# Altium project Altium-TableTennisX3.PrjPcb
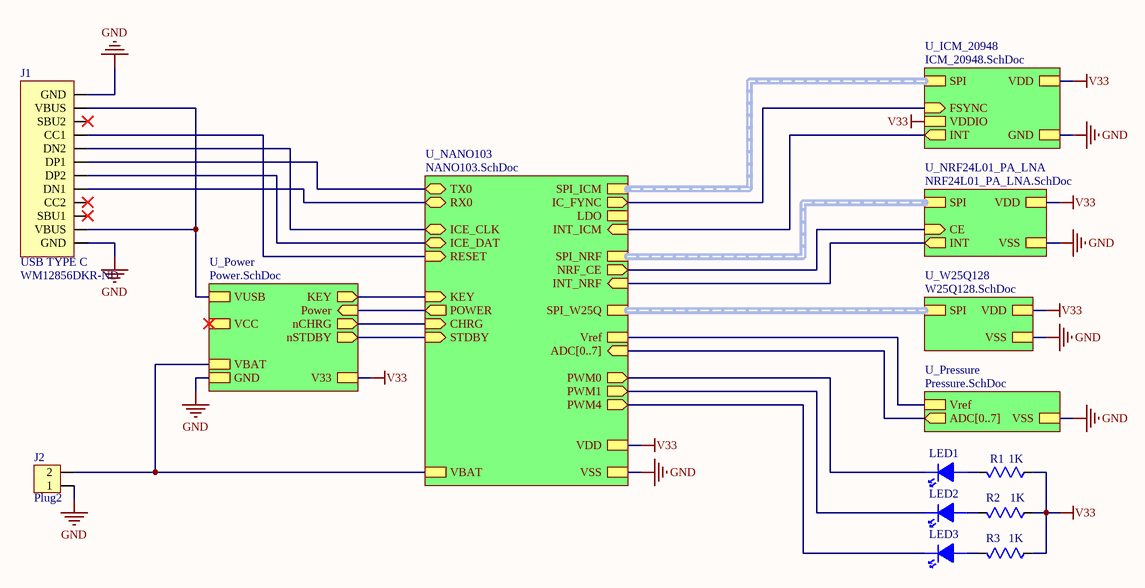
[diagram p0: Sheet1.SchDoc]
7 sheets, 62 parts. Net scope: hierarchical (ports join the sheet entries above them; power ports are global).
Board files: PCB1.PcbDoc, PCB2_bak.PcbDoc, PCB2.PcbDoc
Sheets:
  Sheet1.SchDoc
    U_Power = Power.SchDoc
    U_W25Q128 = W25Q128.SchDoc
    U_ICM_20948 = ICM_20948.SchDoc
    U_NRF24L01_PA_LNA = NRF24L01_PA_LNA.SchDoc
    U_NANO103 = NANO103.SchDoc
    U_Pressure = Pressure.SchDoc

## Sheet Sheet1.SchDoc
size A4

### Parts
J1  USB TYPE C  Supplier Part Number 1: WM12856DKR-ND  [USBC-SMD16F]
J2  Plug2  [Terminal_block_2pin_1.25mm_SMD]
LED1  LED  [SMD-0603_LED]  (value not drawn)
LED2  LED  [SMD-0603_LED]  (value not drawn)
LED3  LED  [SMD-0603_LED]  (value not drawn)
R1  value 1K  [RES_0402]  (hidden comment: Res)
R2  value 1K  [RES_0402]  (hidden comment: Res)
R3  value 1K  [RES_0402]  (hidden comment: Res)

### Sub-sheets
U_ICM_20948 = ICM_20948.SchDoc: GND, INT (out), FSYNC (in), VDD, VDDIO, SPI (harness SPI)
U_NANO103 = NANO103.SchDoc: ADC[0..7] (in), SPI_ICM (harness SPI), SPI_W25Q (harness SPI), SPI_NRF (harness SPI), INT_ICM (in), INT_NRF (in), CHRG (in), STDBY (in), KEY (in), POWER (out), TX0 (bidir), RX0 (bidir), PWM0 (out), PWM1 (out), PWM4 (out), Vref, VDD, VSS, RESET (in), NRF_CE (out), ICE_CLK (bidir), ICE_DAT (bidir), LDO, VBAT, IC_FYNC (out)
U_NRF24L01_PA_LNA = NRF24L01_PA_LNA.SchDoc: VDD, VSS, INT (out), CE (in), SPI (harness SPI)
U_Power = Power.SchDoc: VCC, KEY (out), GND, Power (in), V33, VUSB, nCHRG (out), nSTDBY (out), VBAT
U_Pressure = Pressure.SchDoc: VSS, ADC[0..7] (out), Vref
U_W25Q128 = W25Q128.SchDoc: SPI (harness SPI), VDD, VSS

### Nets
GND: J1.1(GND) J1.12(GND) J2.1 ; sheet U_Power/GND, sheet U_W25Q128/VSS, sheet U_ICM_20948/GND, sheet U_NRF24L01_PA_LNA/VSS, sheet U_NANO103/VSS, sheet U_Pressure/VSS  [project net VSS]
V33: R1.2 R2.2 R3.2 ; sheet U_Power/V33, sheet U_W25Q128/VDD, sheet U_ICM_20948/VDD, sheet U_ICM_20948/VDDIO, sheet U_NRF24L01_PA_LNA/VDD, sheet U_NANO103/VDD
/RESET: J1.4(CC1) ; sheet U_NANO103/RESET
CE: sheet U_NRF24L01_PA_LNA/CE, sheet U_NANO103/NRF_CE
ICE_CLK: J1.5(DN2) ; sheet U_NANO103/ICE_CLK
ICE_DAT: J1.7(DP2) ; sheet U_NANO103/ICE_DAT
INT: sheet U_NRF24L01_PA_LNA/INT, sheet U_NANO103/INT_NRF
INT1: sheet U_ICM_20948/INT, sheet U_NANO103/INT_ICM
PA12_PWM0: LED1.2 ; sheet U_NANO103/PWM0
PA13_PWM1: LED2.2 ; sheet U_NANO103/PWM1
PB11_PWM4: LED3.2 ; sheet U_NANO103/PWM4
PD6: sheet U_Power/Power, sheet U_NANO103/POWER
PD7: sheet U_Power/KEY, sheet U_NANO103/KEY
PD14: sheet U_Power/nSTDBY, sheet U_NANO103/STDBY
PD15: sheet U_Power/nCHRG, sheet U_NANO103/CHRG
PE5: sheet U_ICM_20948/FSYNC, sheet U_NANO103/IC_FYNC
RX0: J1.8(DN1) ; sheet U_NANO103/RX0
TX0: J1.6(DP1) ; sheet U_NANO103/TX0
VBAT: J2.2 ; sheet U_Power/VBAT, sheet U_NANO103/VBAT
Vref: sheet U_NANO103/Vref, sheet U_Pressure/Vref
NetC14_1: J1.2(VBUS) J1.11(VBUS) ; sheet U_Power/VUSB
NetLED1_1: LED1.1 R1.1
NetLED2_1: LED2.1 R2.1
NetLED3_1: LED3.1 R3.1

Not connected (* = marked no-connect by the designer): J1 3(SBU2)* 9(CC2)* 10(SBU1)*

### Buses and harness runs
bus sheet U_NANO103/ADC[0..7] = sheet U_Pressure/ADC[0..7]
harness sheet U_ICM_20948/SPI = sheet U_NANO103/SPI_ICM
harness sheet U_NANO103/SPI_NRF = sheet U_NRF24L01_PA_LNA/SPI
harness sheet U_NANO103/SPI_W25Q = sheet U_W25Q128/SPI

### Library data of the parts
J1 = USB TYPE C: USB Shielded I/O Receptacle; Type C; Right Angle; Surface Mount; Gold over Nickel; Manufacturer: Molex; Manufacturer Part Number: 105450-0101; Number of Contacts: 24; Current Rating: 5A; Mating Cycles: 10000; USB Standard: USB 3.1; Number of Ports: 1; Pitch: 0.5mm; Supplier 1: Digi-Key; RoHS: Yes; Category: Connectors; Stock 1: 21711; Pricing 1: 1=2.15000, 10=1.94900, 25=1.82960, 50=1.75000, 100=1.67050, 250=1.51140, 500=1.39208 (USD); Mount: Surface Mount,Through Hole,Horizontal; Case/Package: 0101; Number of Pins: 24; Contact Plating: Gold; Contact Material: Copper Alloy; Housing Material: Thermoplastic; Insulation Color: Black; Number of Terminals: 24; Min Operating Temperature: -30°C; Max Operating Temperature: 85°C; Packaging: Tape and Reel; Gender: Receptacle; Connector Type: USB; Orientation: Right Angle; Termination: Solder; Shielding: Shielded; Features: Shielded; Length: 8.94mm; REACH SVHC: Unknown; Flammability Rating: UL94 V-0; ComponentLink1URL: http://www.farnell.com/datasheets/2801634.pdf?src-supplier=Farnell; ComponentLink1Description: http://www.farnell.com/datasheets/2801634.pdf?src-supplier=Farnell; ComponentLink2URL: http://www.farnell.com/datasheets/2672741.pdf?src-supplier=Newark; ComponentLink2Description: http://www.farnell.com/datasheets/2672741.pdf?src-supplier=Newark; ComponentLink3URL: http://www.farnell.com/datasheets/2015275.pdf?src-supplier=Element14; ComponentLink3Description: http://www.farnell.com/datasheets/2015275.pdf?src-supplier=Element14; ComponentLink4URL: https://www.molex.com/pdm_docs/ps/PS-105448-001.pdf?src-supplier=Digi-Key; ComponentLink4Description: https://www.molex.com/pdm_docs/ps/PS-105448-001.pdf?src-supplier=Digi-Key; ComponentLink5URL: http://www.farnell.com/datasheets/2801634.pdf?src-supplier=Newark; ComponentLink5Description: http://www.farnell.com/datasheets/2801634.pdf?src-supplier=Newark; ComponentLink6URL: https://www.molex.com/pdm_docs/sd/1054500101_sd.pdf?src-supplier=Digi-Key; ComponentLink6Description: https://www.molex.com/pdm_docs/sd/1054500101_sd.pdf?src-supplier=Digi-Key; ComponentLink7URL: http://www.farnell.com/datasheets/2801634.pdf?src-supplier=Element14; ComponentLink7Description: http://www.farnell.com/datasheets/2801634.pdf?src-supplier=Element14; ComponentLink8URL: http://www.literature.molex.com/SQLImages/kelmscott/Molex/PDF_Images/987651-4081.PDF?src-supplier=Avnet; ComponentLink8Description: http://www.literature.molex.com/SQLImages/kelmscott/Molex/PDF_Images/987651-4081.PDF?src-supplier=Avnet; ComponentLink9URL: http://www.literature.molex.com/SQLImages/kelmscott/Molex/PDF_Images/987651-4081.PDF?src-supplier=Avnet+Asia; ComponentLink9Description: http://www.literature.molex.com/SQLImages/kelmscott/Molex/PDF_Images/987651-4081.PDF?src-supplier=Avnet+Asia

## Sheet Power.SchDoc
size A4
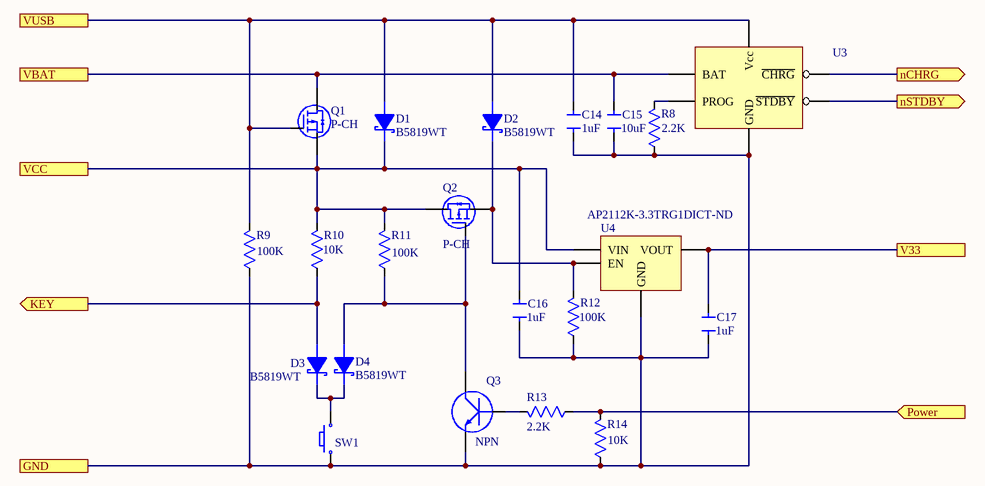
[diagram p1: Power.SchDoc]

### Parts
C14  value 1uF  [CAP_0402]  (hidden comment: Cap)
C15  value 10uF  [Cap_0603]  (hidden comment: Cap)
C16  value 1uF  [CAP_0402]  (hidden comment: Cap)
C17  value 1uF  [CAP_0402]  (hidden comment: Cap)
D1  B5819WT  [SOD-523]
D2  B5819WT  [SOD-523]
D3  B5819WT  [SOD-523]
D4  B5819WT  [SOD-523]
Q1  Polarity: P-CH  [SOT-23]  (hidden comment: SI2301DS-T1)
Q2  Polarity: P-CH  [SOT-23]  (hidden comment: SI2301DS-T1)
Q3  Polarity: NPN  [SOT-23]  (hidden comment: MMS9013L-TP)
R8  value 2.2K  [RES_0402]  (hidden comment: Res)
R9  value 100K  [RES_0402]  (hidden comment: Res)
R10  value 10K  [RES_0402]  (hidden comment: Res)
R11  value 100K  [RES_0402]  (hidden comment: Res)
R12  value 100K  [RES_0402]  (hidden comment: Res)
R13  value 2.2K  [RES_0402]  (hidden comment: Res)
R14  value 10K  [RES_0402]  (hidden comment: Res)
SW1  SPST  [ST01-111]  (value not drawn)
U3  TP4059  [SOT23-6]  (value not drawn)
U4  Supplier Part Number 1: AP2112K-3.3TRG1DICT-ND  [SOT23-5]  (hidden comment: AP2112K-3.3TRG1)

### Ports
GND, KEY (out), nCHRG (out), nSTDBY (out), Power (in), V33, VBAT, VCC, VUSB

### Nets
V33: C17.1 U4.4(VOUT) ; port V33
VSS: C14.2 C15.2 C16.2 C17.2 Q3.3 R8.2 R9.2 R12.2 R14.2 SW1.2 U3.4(GND) U4.3(GND) ; port GND
PD6: R13.2 R14.1 ; port Power
PD7: D3.1 R10.2 ; port KEY
PD14: U3.3(~{STDBY}) ; port nSTDBY
PD15: U3.2(~{CHRG}) ; port nCHRG
VBAT: C15.1 Q1.1 U3.6(BAT) ; port VBAT
NetC14_1: C14.1 D1.1 D2.1 Q1.2 R9.1 U3.1(Vcc) ; port VUSB
NetC16_1: C16.1 D1.2 Q1.3 Q2.1 R10.1 R11.1 U4.1(VIN) ; port VCC
NetD2_2: D2.2 Q2.3 R12.1 U4.2(EN)
NetD3_2: D3.2 D4.2 SW1.1
NetD4_1: D4.1 Q2.2 Q3.1 R11.2
NetQ3_2: Q3.2 R13.1
NetR8_1: R8.1 U3.5(PROG)

### Library data of the parts
D1-D4 = B5819WT: Diode Schottky 40V 1A 2-Pin SOD-523 T/R; Manufacturer: MCC; Manufacturer Part Number: B5819W-TP; Max Reverse Voltage (DC): 20V; Element Configuration: Single; Forward Voltage: 550mV; Max Forward Surge Current (Ifsm): 10A; Peak Reverse Current: 1mA; Max Power Dissipation: 250mW; Supplier 1: Digi-Key; RoHS: Yes; Category: Rectifier Diodes; Stock 1: 1380; Pricing 1: 1=0.38000, 10=0.28000, 25=0.24520, 100=0.13300, 250=0.13232, 500=0.10850, 1000=0.08050 (USD); Mount: Surface Mount; Min Operating Temperature: -65°C; Max Operating Temperature: 125°C; Reverse Voltage (DC): 40V; Average Rectified Current: 1A; Package Quantity: 3000; Packaging: Tape and Reel; Forward Current: 1A; Max Repetitive Reverse Voltage (Vrrm): 40V; ComponentLink1URL: https://datasheet.ciiva.com/6378/b5817w-b5819wsod-123-6378255.pdf?src-supplier=Digi-Key; ComponentLink1Description: https://datasheet.ciiva.com/6378/b5817w-b5819wsod-123-6378255.pdf?src-supplier=Digi-Key; Supplier Part Number 1: B5819WT
Q1 Q2 = SI2301DS-T1: Trans MOSFET P-CH 20V 2.3A 3-Pin TO-236 T/R; pin to pad: 1>2 2>1; Manufacturer: Vishay Siliconix; Rise Time: 36ns; Drain to Source Resistance: 130mR; Gate to Source Voltage (Vgs): 8V; Max Power Dissipation: 1.25W; Turn-Off Delay Time: 42ns; Turn-On Delay Time: 13ns; Number of Elements: 1; Element Configuration: Single; Drain to Source Voltage (Vdss): -20V; Supplier 1: Component Sense; Manufacturer Part Number: SI2301DS-T1; RoHS: No; Category: MOSFETs; Stock 1: 12531; Pricing 1: 143=0.17500, 500=0.15000, 1000=0.10000, 5000=0.09000, 10000=0.08000 (USD); Mount: Surface Mount; Case/Package: SOT-23-3; Number of Pins: 3; Weight: 0.050717oz; Min Operating Temperature: -55°C; Max Operating Temperature: 150°C; Packaging: Tape and Reel; Package Quantity: 3000; Continuous Drain Current (ID): 2.3A; Fall Time: 36ns; Power Dissipation: 1.25W; Number of Channels: 1; Length: 3.04mm; Height: 1.02mm; Width: 1.4mm; ComponentLink1URL: https://datasheet.ciiva.com/13048/70627-115154-13048148.pdf?src-supplier=Mouser; ComponentLink1Description: https://datasheet.ciiva.com/13048/70627-115154-13048148.pdf?src-supplier=Mouser; Supplier Part Number 1: SI2301DS-T1
Q3 = MMS9013L-TP: Trans GP BJT NPN 25V 0.5A 3-Pin SOT-23 T/R; pin to pad: 1>3 2>1 3>2; Manufacturer: MCC; Frequency: 150MHz; Number of Elements: 1; Collector Base Voltage (VCBO): 40V; Emitter Base Voltage (VEBO): 5V; Power Dissipation: 300mW; Manufacturer Part Number: MMS9013L-TP; RoHS: Yes; Category: BJTs; Mount: Surface Mount; Case/Package: SOT-23; Number of Pins: 3; Min Operating Temperature: -55°C; Max Operating Temperature: 150°C; Packaging: Tape and Reel; Collector Emitter Voltage (VCEO): 25V; ComponentLink1URL: http://components.arrow.com/part/dataview/51062823S110403N2022?src-supplier=Arrow; ComponentLink1Description: http://components.arrow.com/part/dataview/51062823S110403N2022?src-supplier=Arrow; Supplier 1: Arrow; Supplier Part Number 1: MMS9013-L-TP
SW1 = Switch_Button1
U3 = TP4059: 600MA SOT23-6; pin to pad: 1>4 2>1 3>5 4>2 5>6 6>3; ComponentLink1Description: Datasheet; ComponentLink1URL: http://www.tp-asic.com/res/tp-asic/pdres/201403/TP4059.pdf
U4 = AP2112K-3.3TRG1: IC REG LINEAR 3.3V 600MA SOT23-5; pin to pad: 2>3 3>2 4>5; Manufacturer: Diodes; Number of Regulators: 1; Quiescent Current: 55uA; Polarity: Positive; Max Input Voltage: 6V; Min Input Voltage: 2.5V; Accuracy: 1.5%; Dropout Voltage: 250mV; Output Type: Fixed; Supplier 1: Digi-Key; Manufacturer Part Number: AP2112K-3.3TRG1; RoHS: Yes; Category: Voltage Regulators - Linear; Stock 1: 54786; Pricing 1: 1=0.47000, 10=0.35500, 25=0.32000, 100=0.17450, 250=0.16872, 500=0.15126, 1000=0.11636 (USD); Mount: Surface Mount; Case/Package: SOT-23-5; Number of Pins: 5; Min Operating Temperature: -40°C; Max Operating Temperature: 85°C; Output Current: 600mA; Max Output Current: 600mA; Output Voltage: 3.3V; Number of Outputs: 1; Package Quantity: 1; Packaging: Tape and Reel; Length: 3.1mm; Height: 1.3mm; Width: 1.7mm; Lead Free: Lead Free; ComponentLink1URL: https://datasheet.ciiva.com/29569/ap2112-29569919.pdf?src-supplier=Digi-Key; ComponentLink1Description: https://datasheet.ciiva.com/29569/ap2112-29569919.pdf?src-supplier=Digi-Key; ComponentLink2URL: https://datasheet.ciiva.com/30016/ap2112-30016792.pdf?src-supplier=Avnet; ComponentLink2Description: https://datasheet.ciiva.com/30016/ap2112-30016792.pdf?src-supplier=Avnet; ComponentLink3URL: https://datasheet.ciiva.com/29569/ap2112-29569917.pdf?src-supplier=Digi-Key; ComponentLink3Description: https://datasheet.ciiva.com/29569/ap2112-29569917.pdf?src-supplier=Digi-Key; ComponentLink4URL: https://datasheet.ciiva.com/29569/ap2112-29569918.pdf?src-supplier=Digi-Key; ComponentLink4Description: https://datasheet.ciiva.com/29569/ap2112-29569918.pdf?src-supplier=Digi-Key

## Sheet W25Q128.SchDoc
size A4
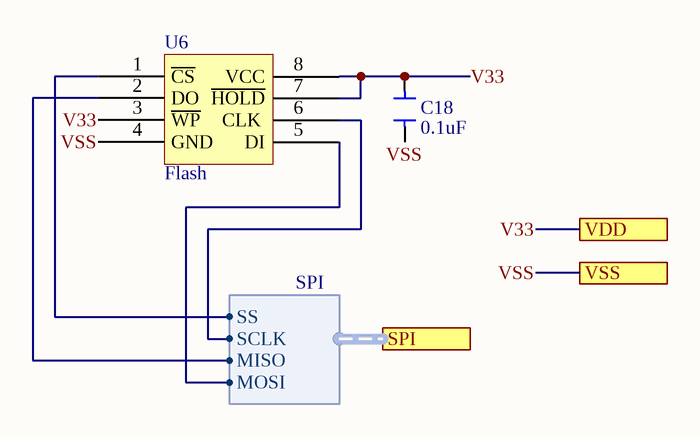
[diagram p2: W25Q128.SchDoc]

### Parts
C18  value 0.1uF  [CAP_0402]  (hidden comment: Cap)
U6  Flash  [8-Pin SOIC 208-mil]

### Ports
SPI (harness SPI), VDD, VSS

### Harnesses
SPI: SS, MISO, MOSI, SCLK

### Nets
V33: C18.1 U6.3(~{WP}) U6.7(~{HOLD}) U6.8(VCC) ; port VDD
VSS: C18.2 U6.4(GND) ; port VSS
SPI1_MISO: U6.2(DO) ; port SPI.MISO
SPI1_MOSI: U6.5(DI) ; port SPI.MOSI
SPI1_SCLK: U6.6(CLK) ; port SPI.SCLK
SPI1_SS: U6.1(~{CS}) ; port SPI.SS

### Library data of the parts
U6 = W25QXX

## Sheet ICM_20948.SchDoc
size A4
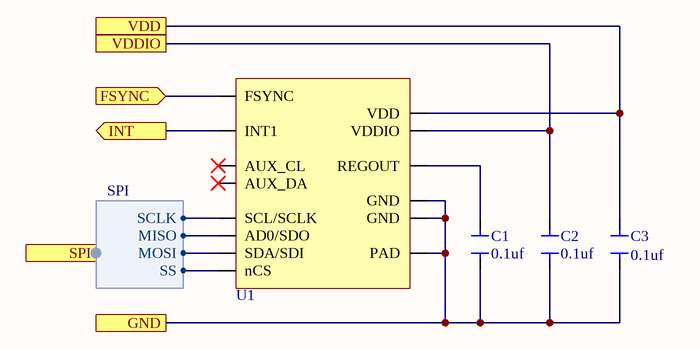
[diagram p3: ICM_20948.SchDoc]

### Parts
C1  value 0.1uf  [CAP_0402]  (hidden comment: Cap)
C2  value 0.1uf  [CAP_0402]  (hidden comment: Cap)
C3  value 0.1uf  [CAP_0402]  (hidden comment: Cap)
U1  ICM-20948  [QFN_24_3X3]  (value not drawn)

### Ports
FSYNC (in), GND, INT (out), SPI (harness SPI), VDD, VDDIO

### Harnesses
SPI: SS, SCLK, MISO, MOSI

### Nets
V33: C2.1 C3.1 U1.8(VDDIO) U1.13(VDD) ; port VDD, port VDDIO
VSS: C1.2 C2.2 C3.2 U1.18(GND) U1.20(GND) U1.25(PAD) ; port GND
INT1: U1.12(INT1) ; port INT
PE5: U1.11(FSYNC) ; port FSYNC
SPI0_MISO: U1.9(AD0/SDO) ; port SPI.MISO
SPI0_MOSI: U1.24(SDA/SDI) ; port SPI.MOSI
SPI0_SCLK: U1.23(SCL/SCLK) ; port SPI.SCLK
SPI0_SS: U1.22(nCS) ; port SPI.SS
NetC1_1: C1.1 U1.10(REGOUT)

Not connected (* = marked no-connect by the designer): U1 7(AUX_CL)* 21(AUX_DA)*

### Library data of the parts
U1 = ICM-20948: Accelerometer, Gyroscope, Magnetometer, 9 Axis Sensor IÂ²C, SPI Output; MF: TDK InvenSense; Availability: Unavailable; SnapEDA_Link: https://www.snapeda.com/parts/ICM-20948/TDK%20InvenSense/view-part/578927/?ref=snap; Price: None; Value: *; Package: QFN-24 InvenSense; MP: ICM-20948

## Sheet NRF24L01_PA_LNA.SchDoc
size A4
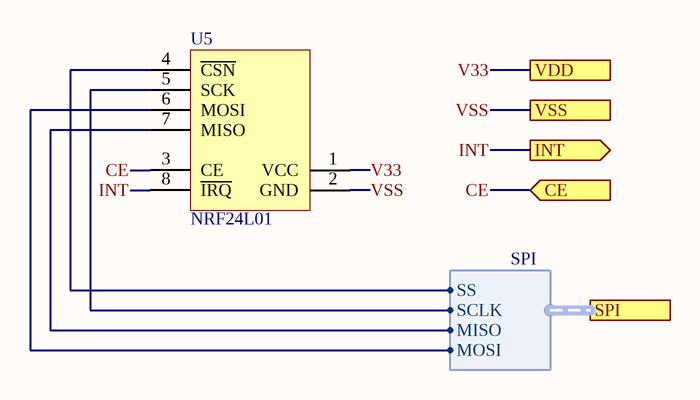
[diagram p4: NRF24L01_PA_LNA.SchDoc]

### Parts
U5  NRF24L01  [NRF24L01P+PA+LNA+IPX]

### Ports
CE (in), INT (out), SPI (harness SPI), VDD, VSS

### Harnesses
SPI: SS, MISO, MOSI, SCLK

### Nets
V33: U5.1(VCC) ; port VDD
VSS: U5.2(GND) ; port VSS
CE: U5.3(CE) ; port CE
INT: U5.8(~{IRQ}) ; port INT
SPI2_MISO: U5.7(MISO) ; port SPI.MISO
SPI2_MOSI: U5.6(MOSI) ; port SPI.MOSI
SPI2_SCLK: U5.5(SCK) ; port SPI.SCLK
SPI2_SS: U5.4(~{CSN}) ; port SPI.SS

### Library data of the parts
U5 = NRF24L01_module: pin to pad: 2>8 3>2 4>3 5>4 6>5 7>6 8>7

## Sheet NANO103.SchDoc
size A3
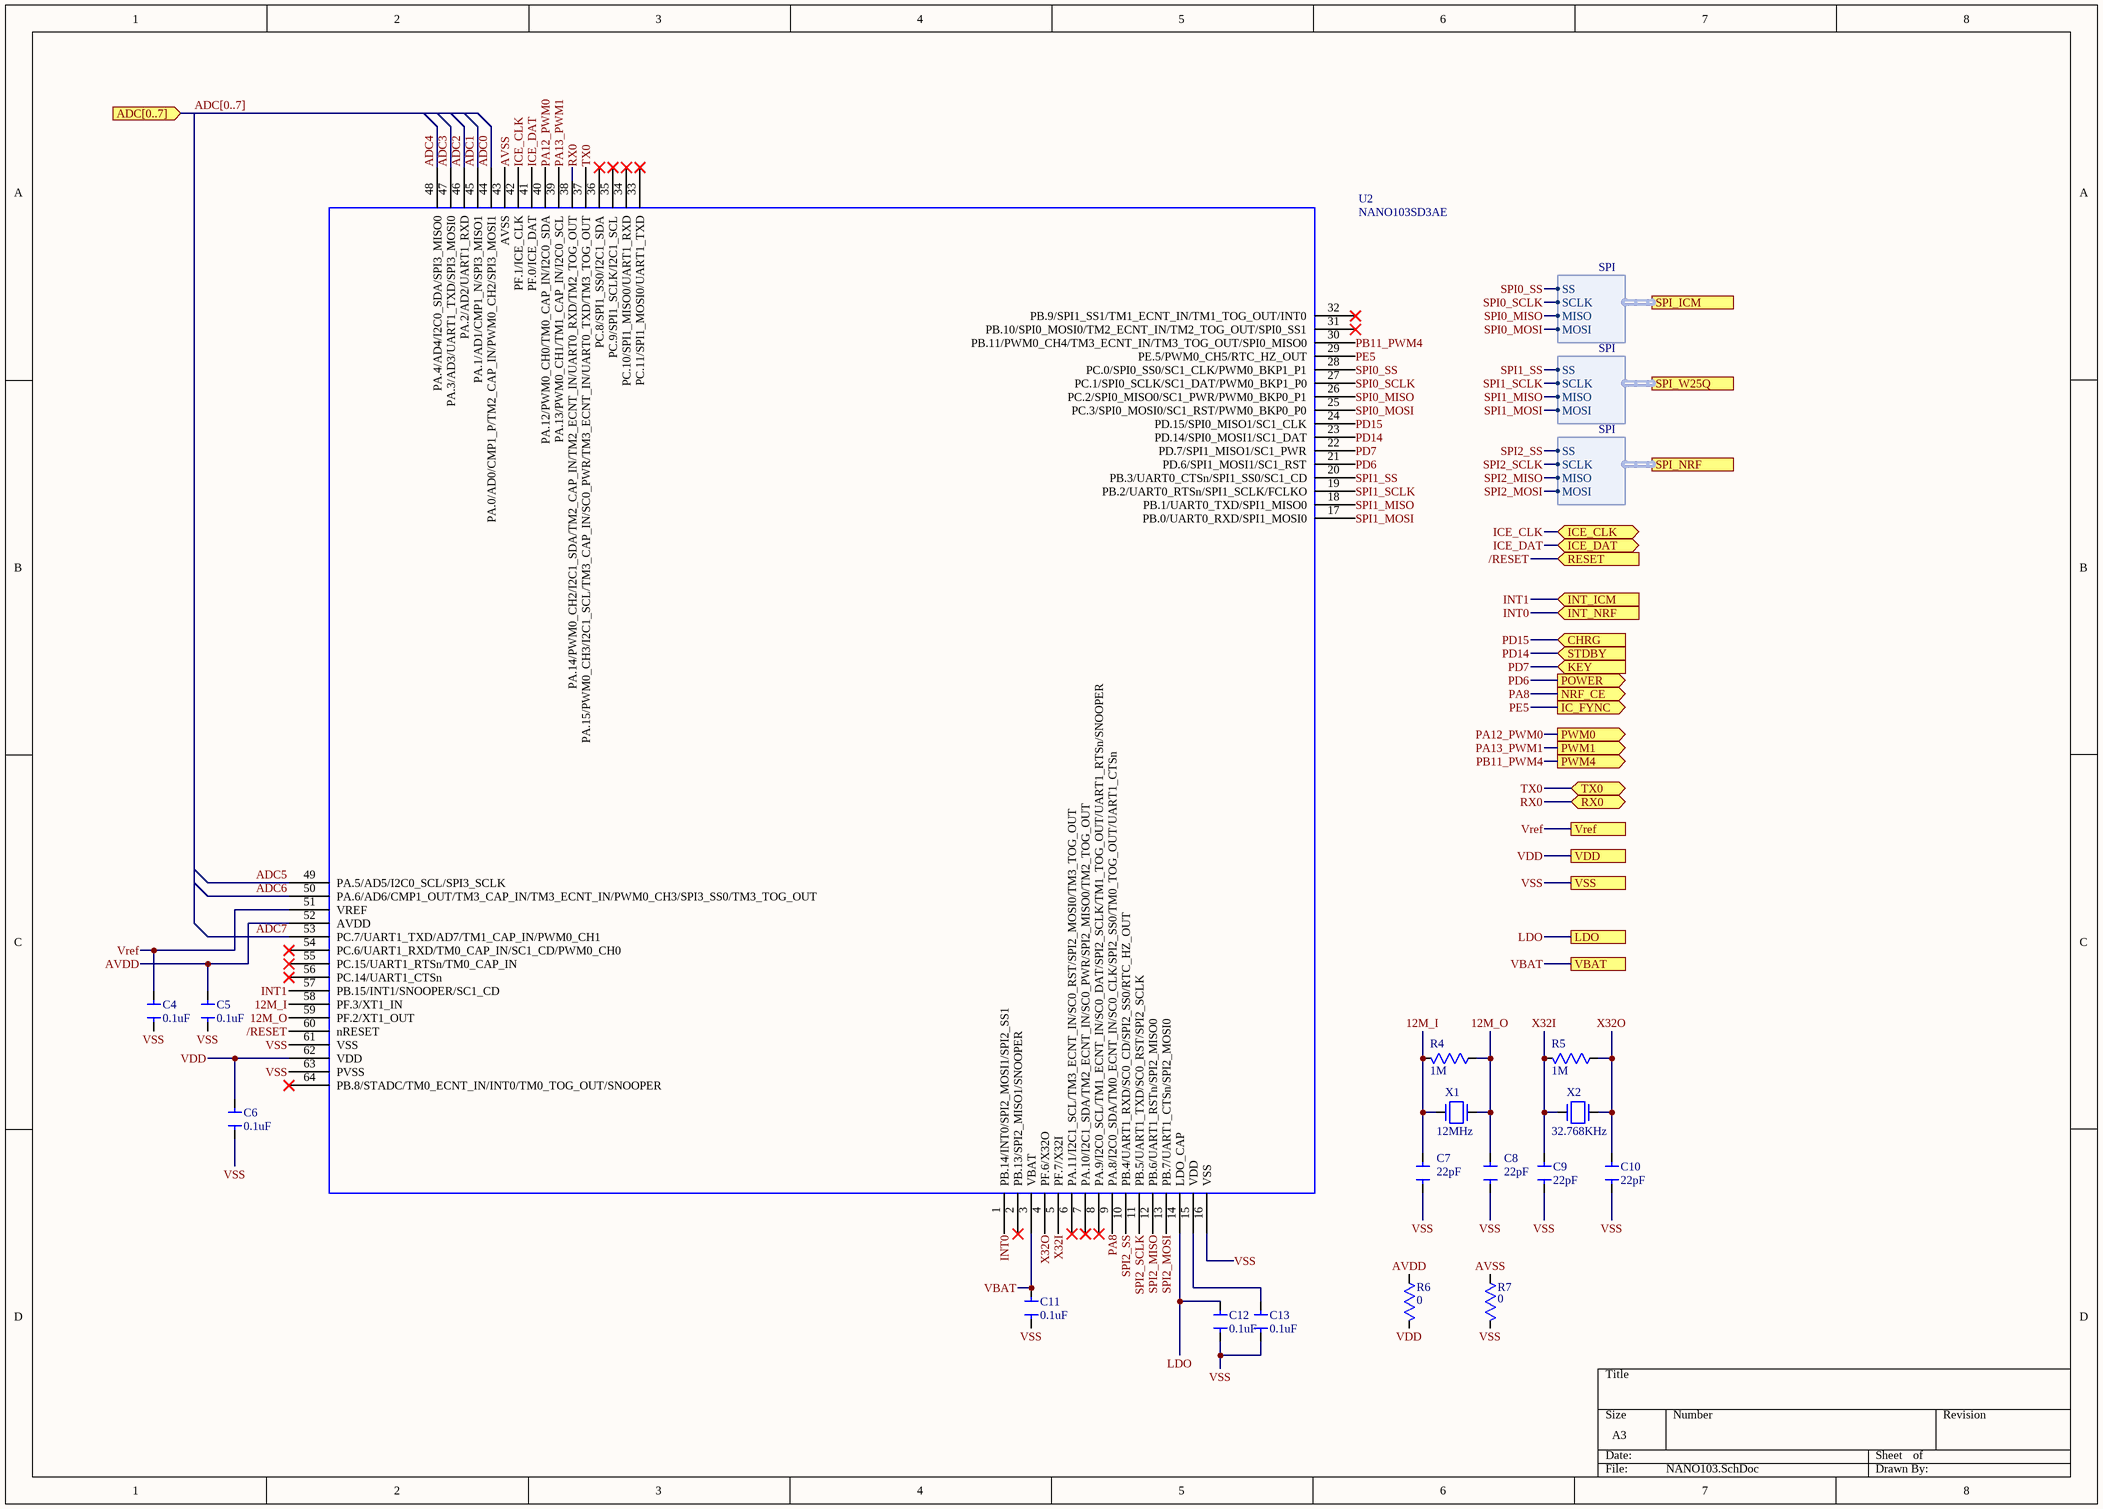
[diagram p5: NANO103.SchDoc]

### Parts
C4  value 0.1uF  [CAP_0402]  (hidden comment: Cap)
C5  value 0.1uF  [CAP_0402]  (hidden comment: Cap)
C6  value 0.1uF  [CAP_0402]  (hidden comment: Cap)
C7  value 22pF  [CAP_0402]  (hidden comment: Cap)
C8  value 22pF  [CAP_0402]  (hidden comment: Cap)
C9  value 22pF  [CAP_0402]  (hidden comment: Cap)
C10  value 22pF  [CAP_0402]  (hidden comment: Cap)
C11  value 0.1uF  [CAP_0402]  (hidden comment: Cap)
C12  value 0.1uF  [CAP_0402]  (hidden comment: Cap)
C13  value 0.1uF  [CAP_0402]  (hidden comment: Cap)
R4  value 1M  [RES_0402]  (hidden comment: Res)
R5  value 1M  [RES_0402]  (hidden comment: Res)
R6  value 0  [RES_0402]  (hidden comment: Res)
R7  value 0  [RES_0402]  (hidden comment: Res)
U2  NANO103SD3AE  [MCU_LQFP_64_7x7]
X1  value 12MHz  [2520S]  (hidden comment: Xtal)
X2  value 32.768KHz  [FC-135]  (hidden comment: Xtal)

### Ports
ADC[0..7] (in), CHRG (in), IC_FYNC (out), ICE_CLK (bidir), ICE_DAT (bidir), INT_ICM (in), INT_NRF (in), KEY (in), LDO, NRF_CE (out), POWER (out), PWM0 (out), PWM1 (out), PWM4 (out), RESET (in), RX0 (bidir), SPI_ICM (harness SPI), SPI_NRF (harness SPI), SPI_W25Q (harness SPI), STDBY (in), TX0 (bidir), VBAT, VDD, Vref, VSS

### Harnesses
SPI: SS, MISO, MOSI, SCLK

### Nets
VDD: C6.2 R6.1 U2.62(VDD) ; port VDD  [project net V33]
VSS: C4.1 C5.1 C6.1 C7.2 C8.2 C9.2 C10.2 C11.1 C12.1 C13.1 R7.1 U2.16(VSS) U2.61(VSS) U2.63(PVSS) ; port VSS
12M_I: C7.1 R4.1 U2.58(PF.3/XT1_IN) X1.2
12M_O: C8.1 R4.2 U2.59(PF.2/XT1_OUT) X1.1
/RESET: U2.60(nRESET) ; port RESET
ADC0: U2.44(PA.0/AD0/CMP1_P/TM2_CAP_IN/PWM0_CH2/SPI3_MOSI1)
ADC1: U2.45(PA.1/AD1/CMP1_N/SPI3_MISO1)
ADC2: U2.46(PA.2/AD2/UART1_RXD)
ADC3: U2.47(PA.3/AD3/UART1_TXD/SPI3_MOSI0)
ADC4: U2.48(PA.4/AD4/I2C0_SDA/SPI3_MISO0)
ADC5: U2.49(PA.5/AD5/I2C0_SCL/SPI3_SCLK)
ADC6: U2.50(PA.6/AD6/CMP1_OUT/TM3_CAP_IN/TM3_ECNT_IN/PWM0_CH3/SPI3_SS0/TM3_TOG_OUT)
ADC7: U2.53(PC.7/UART1_TXD/AD7/TM1_CAP_IN/PWM0_CH1)
AVDD: C5.2 R6.2 U2.52(AVDD)
AVSS: R7.2 U2.43(AVSS)
ICE_CLK: U2.42(PF.1/ICE_CLK) ; port ICE_CLK
ICE_DAT: U2.41(PF.0/ICE_DAT) ; port ICE_DAT
INT0: U2.1(PB.14/INT0/SPI2_MOSI1/SPI2_SS1) ; port INT_NRF  [project net INT]
INT1: U2.57(PB.15/INT1/SNOOPER/SC1_CD) ; port INT_ICM
LDO: C12.2 U2.14(LDO_CAP) ; port LDO
PA8: U2.9(PA.8/I2C0_SDA/TM0_ECNT_IN/SC0_CLK/SPI2_SS0/TM0_TOG_OUT/UART1_CTSn) ; port NRF_CE  [project net CE]
PA12_PWM0: U2.40(PA.12/PWM0_CH0/TM0_CAP_IN/I2C0_SDA) ; port PWM0
PA13_PWM1: U2.39(PA.13/PWM0_CH1/TM1_CAP_IN/I2C0_SCL) ; port PWM1
PB11_PWM4: U2.30(PB.11/PWM0_CH4/TM3_ECNT_IN/TM3_TOG_OUT/SPI0_MISO0) ; port PWM4
PD6: U2.21(PD.6/SPI1_MOSI1/SC1_RST) ; port POWER
PD7: U2.22(PD.7/SPI1_MISO1/SC1_PWR) ; port KEY
PD14: U2.23(PD.14/SPI0_MOSI1/SC1_DAT) ; port STDBY
PD15: U2.24(PD.15/SPI0_MISO1/SC1_CLK) ; port CHRG
PE5: U2.29(PE.5/PWM0_CH5/RTC_HZ_OUT) ; port IC_FYNC
RX0: U2.38(PA.14/PWM0_CH2/I2C1_SDA/TM2_CAP_IN/TM2_ECNT_IN/UART0_RXD/TM2_TOG_OUT) ; port RX0
SPI0_MISO: U2.26(PC.2/SPI0_MISO0/SC1_PWR/PWM0_BKP0_P1) ; port SPI_ICM.MISO
SPI0_MOSI: U2.25(PC.3/SPI0_MOSI0/SC1_RST/PWM0_BKP0_P0) ; port SPI_ICM.MOSI
SPI0_SCLK: U2.27(PC.1/SPI0_SCLK/SC1_DAT/PWM0_BKP1_P0) ; port SPI_ICM.SCLK
SPI0_SS: U2.28(PC.0/SPI0_SS0/SC1_CLK/PWM0_BKP1_P1) ; port SPI_ICM.SS
SPI1_MISO: U2.18(PB.1/UART0_TXD/SPI1_MISO0) ; port SPI_W25Q.MISO
SPI1_MOSI: U2.17(PB.0/UART0_RXD/SPI1_MOSI0) ; port SPI_W25Q.MOSI
SPI1_SCLK: U2.19(PB.2/UART0_RTSn/SPI1_SCLK/FCLKO) ; port SPI_W25Q.SCLK
SPI1_SS: U2.20(PB.3/UART0_CTSn/SPI1_SS0/SC1_CD) ; port SPI_W25Q.SS
SPI2_MISO: U2.12(PB.6/UART1_RSTn/SPI2_MISO0) ; port SPI_NRF.MISO
SPI2_MOSI: U2.13(PB.7/UART1_CTSn/SPI2_MOSI0) ; port SPI_NRF.MOSI
SPI2_SCLK: U2.11(PB.5/UART1_TXD/SC0_RST/SPI2_SCLK) ; port SPI_NRF.SCLK
SPI2_SS: U2.10(PB.4/UART1_RXD/SC0_CD/SPI2_SS0/RTC_HZ_OUT) ; port SPI_NRF.SS
TX0: U2.37(PA.15/PWM0_CH3/I2C1_SCL/TM3_CAP_IN/SC0_PWR/TM3_ECNT_IN/UART0_TXD/TM3_TOG_OUT) ; port TX0
VBAT: C11.2 U2.3(VBAT) ; port VBAT
Vref: C4.2 U2.51(VREF) ; port Vref
X32I: C9.1 R5.1 U2.5(PF.7/X32I) X2.2
X32O: C10.1 R5.2 U2.4(PF.6/X32O) X2.1
NetC13_2: C13.2 U2.15(VDD)

Not connected (* = marked no-connect by the designer): U2 2(PB.13/SPI2_MISO1/SNOOPER)* 6(PA.11/I2C1_SCL/TM3_ECNT_IN/SC0_RST/SPI2_MOSI0/TM3_TOG_OUT)* 7(PA.10/I2C1_SDA/TM2_ECNT_IN/SC0_PWR/SPI2_MISO0/TM2_TOG_OUT)* 8(PA.9/I2C0_SCL/TM1_ECNT_IN/SC0_DAT/SPI2_SCLK/TM1_TOG_OUT/UART1_RTSn/SNOOPER)* 31(PB.10/SPI0_MOSI0/TM2_ECNT_IN/TM2_TOG_OUT/SPI0_SS1)* 32(PB.9/SPI1_SS1/TM1_ECNT_IN/TM1_TOG_OUT/INT0)* 33(PC.11/SPI1_MOSI0/UART1_TXD)* 34(PC.10/SPI1_MISO0/UART1_RXD)* 35(PC.9/SPI1_SCLK/I2C1_SCL)* 36(PC.8/SPI1_SS0/I2C1_SDA)* 54(PC.6/UART1_RXD/TM0_CAP_IN/SC1_CD/PWM0_CH0)* 55(PC.15/UART1_RTSn/TM0_CAP_IN)* 56(PC.14/UART1_CTSn)* 64(PB.8/STADC/TM0_ECNT_IN/INT0/TM0_TOG_OUT/SNOOPER)*

### Buses and harness runs
bus ADC[0..7] = port ADC[0..7]

### Library data of the parts
U2 = NANO103SD3AE: OriginalSymbolOrigin: (0,0)

## Sheet Pressure.SchDoc
size A4
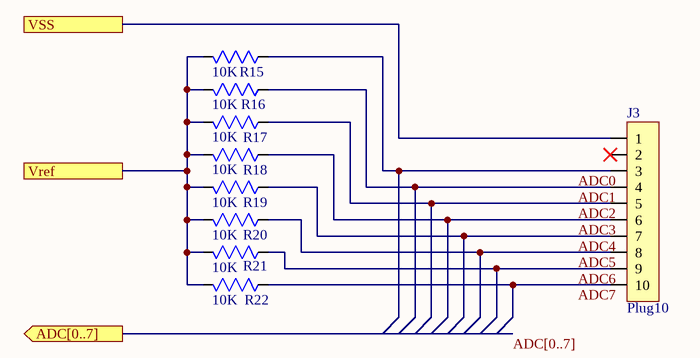
[diagram p6: Pressure.SchDoc]

### Parts
J3  Plug10  [FPC0.5-10PS]
R15  value 10K  [RES_0402]  (hidden comment: Res)
R16  value 10K  [RES_0402]  (hidden comment: Res)
R17  value 10K  [RES_0402]  (hidden comment: Res)
R18  value 10K  [RES_0402]  (hidden comment: Res)
R19  value 10K  [RES_0402]  (hidden comment: Res)
R20  value 10K  [RES_0402]  (hidden comment: Res)
R21  value 10K  [RES_0402]  (hidden comment: Res)
R22  value 10K  [RES_0402]  (hidden comment: Res)

### Ports
ADC[0..7] (out), Vref, VSS

### Nets
VSS: J3.1 ; port VSS
ADC0: J3.3 R15.2
ADC1: J3.4 R16.2
ADC2: J3.5 R17.2
ADC3: J3.6 R18.2
ADC4: J3.7 R19.2
ADC5: J3.8 R20.2
ADC6: J3.9 R21.2
ADC7: J3.10 R22.2
Vref: R15.1 R16.1 R17.1 R18.1 R19.1 R20.1 R21.1 R22.1 ; port Vref

Not connected (* = marked no-connect by the designer): J3 2*

### Buses and harness runs
bus ADC[0..7] = port ADC[0..7]

## Nets that join several sheets
V33: Sheet1 (R1.2 R2.2 R3.2), Power (C17.1 U4.4), W25Q128 (C18.1 U6.3 U6.7 U6.8), ICM_20948 (C2.1 C3.1 U1.8 U1.13), NRF24L01_PA_LNA (U5.1), NANO103 (C6.2 R6.1 U2.62)
VSS: Sheet1 (J1.1 J1.12 J2.1), Power (12 pins), W25Q128 (C18.2 U6.4), ICM_20948 (6 pins), NRF24L01_PA_LNA (U5.2), NANO103 (14 pins), Pressure (J3.1)
/RESET: Sheet1 (J1.4), NANO103 (U2.60)
ADC0: NANO103 (U2.44), Pressure (J3.3 R15.2)
ADC1: NANO103 (U2.45), Pressure (J3.4 R16.2)
ADC2: NANO103 (U2.46), Pressure (J3.5 R17.2)
ADC3: NANO103 (U2.47), Pressure (J3.6 R18.2)
ADC4: NANO103 (U2.48), Pressure (J3.7 R19.2)
ADC5: NANO103 (U2.49), Pressure (J3.8 R20.2)
ADC6: NANO103 (U2.50), Pressure (J3.9 R21.2)
ADC7: NANO103 (U2.53), Pressure (J3.10 R22.2)
CE: NRF24L01_PA_LNA (U5.3), NANO103 (U2.9)
ICE_CLK: Sheet1 (J1.5), NANO103 (U2.42)
ICE_DAT: Sheet1 (J1.7), NANO103 (U2.41)
INT: NRF24L01_PA_LNA (U5.8), NANO103 (U2.1)
INT1: ICM_20948 (U1.12), NANO103 (U2.57)
NetC14_1: Sheet1 (J1.2 J1.11), Power (6 pins)
PA12_PWM0: Sheet1 (LED1.2), NANO103 (U2.40)
PA13_PWM1: Sheet1 (LED2.2), NANO103 (U2.39)
PB11_PWM4: Sheet1 (LED3.2), NANO103 (U2.30)
PD6: Power (R13.2 R14.1), NANO103 (U2.21)
PD7: Power (D3.1 R10.2), NANO103 (U2.22)
PD14: Power (U3.3), NANO103 (U2.23)
PD15: Power (U3.2), NANO103 (U2.24)
PE5: ICM_20948 (U1.11), NANO103 (U2.29)
RX0: Sheet1 (J1.8), NANO103 (U2.38)
SPI0_MISO: ICM_20948 (U1.9), NANO103 (U2.26)
SPI0_MOSI: ICM_20948 (U1.24), NANO103 (U2.25)
SPI0_SCLK: ICM_20948 (U1.23), NANO103 (U2.27)
SPI0_SS: ICM_20948 (U1.22), NANO103 (U2.28)
SPI1_MISO: W25Q128 (U6.2), NANO103 (U2.18)
SPI1_MOSI: W25Q128 (U6.5), NANO103 (U2.17)
SPI1_SCLK: W25Q128 (U6.6), NANO103 (U2.19)
SPI1_SS: W25Q128 (U6.1), NANO103 (U2.20)
SPI2_MISO: NRF24L01_PA_LNA (U5.7), NANO103 (U2.12)
SPI2_MOSI: NRF24L01_PA_LNA (U5.6), NANO103 (U2.13)
SPI2_SCLK: NRF24L01_PA_LNA (U5.5), NANO103 (U2.11)
SPI2_SS: NRF24L01_PA_LNA (U5.4), NANO103 (U2.10)
TX0: Sheet1 (J1.6), NANO103 (U2.37)
VBAT: Sheet1 (J2.2), Power (C15.1 Q1.1 U3.6), NANO103 (C11.2 U2.3)
Vref: NANO103 (C4.2 U2.51), Pressure (8 pins)